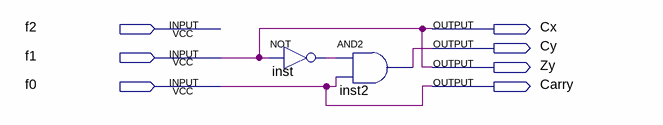
[diagram p0: schematic sheet]
// Quartus schematic Decodificador.bdf as structural Verilog: 2 symbols, 7 pins
module Decodificador (
  input  f2,
  input  f1,
  input  f0,
  output Cx,
  output Cy,
  output Zy,
  output Carry
);

  wire inst_out;

  not inst (inst_out, f1);
  and inst2 (Cy, inst_out, f0);

  assign Carry = f0;
  assign Cx = f1;
  assign Zy = f1;
endmodule
